# EAGLE design moodyv1_final_rzl (EAGLE 6.3)
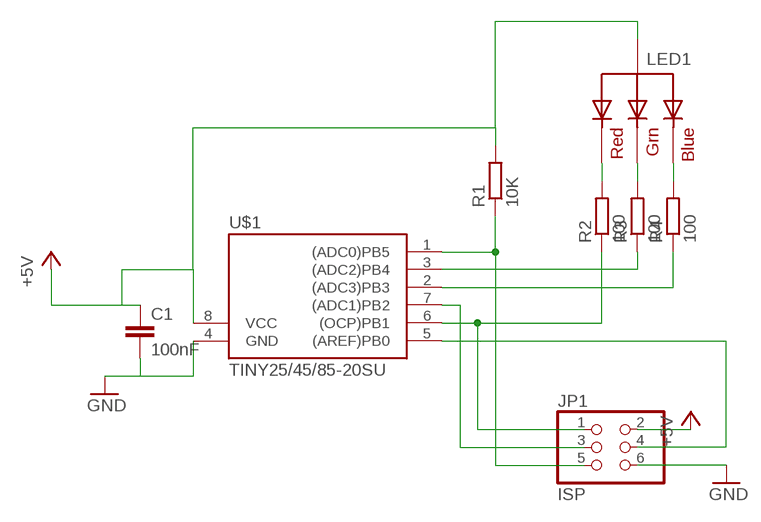
[diagram p0: schematic, sheet 1]

## Parts
C1  100nF  C-EUC0805  [C0805]
JP1  ISP  PINHD-2X03_2.54-SMD  [2X03SMD]
LED1  RGBLED_CA-PIRANHA  [PIRANHA5MM]
R1  10K  R-EU_R1206  [R1206]
R2  100  R-EU_R0805  [R0805]
R3  100  R-EU_R0805  [R0805]
R4  100  R-EU_R0805  [R0805]
U$1  TINY25/45/85-20SU  [SOIC8]

## Nets
+5V: C1.1 JP1.2 LED1.4(VCC) R1.2 U$1.8(VCC)
GND: C1.2 JP1.6 U$1.4(GND)
N$2: JP1.5 R1.1 U$1.1((ADC0)PB5)
N$3: LED1.2(RED) R2.2
N$4: LED1.3(GREEN) R3.2
N$5: LED1.1(BLUE) R4.2
N$6: JP1.4 U$1.5((AREF)PB0)
N$7: JP1.3 U$1.7((ADC1)PB2)
N$8: JP1.1 R2.1 U$1.6((OCP)PB1)
N$9: R4.1 U$1.2((ADC3)PB3)
N$10: R3.1 U$1.3((ADC2)PB4)

## Library data of the parts
C1 = resistor:C-EU: CAPACITOR, European symbol
JP1 = pinhead-2:PINHD-2X03: PIN HEADER
LED1 = adafruit:RGBLED_CA: RGB LED, common-anode 5MM Staggered pins 5mm Piranha package http://www.ladyada.net/library/pcb/eaglelibrary.html
R1-R4 = resistor:R-EU_: RESISTOR, European symbol
U$1 = avr-7:TINY25/45/85

## Net classes
0 default: clearance 0.355 mm

## Board
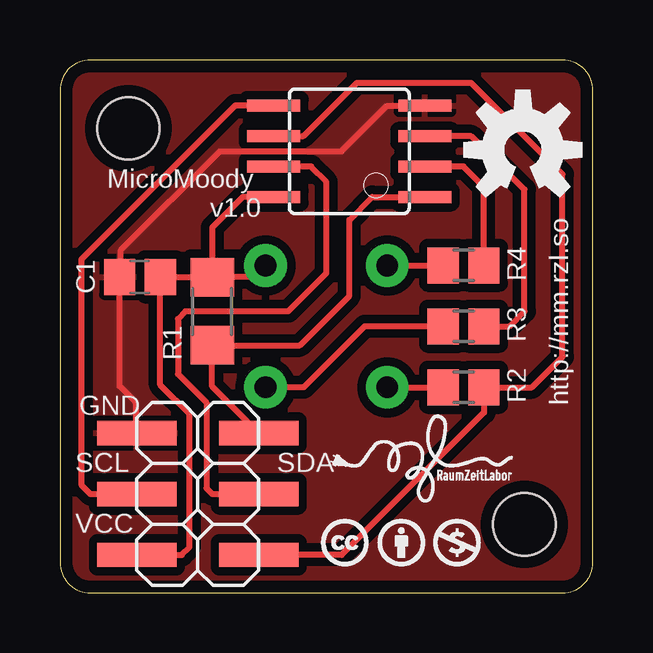
[diagram p1: board, top side]
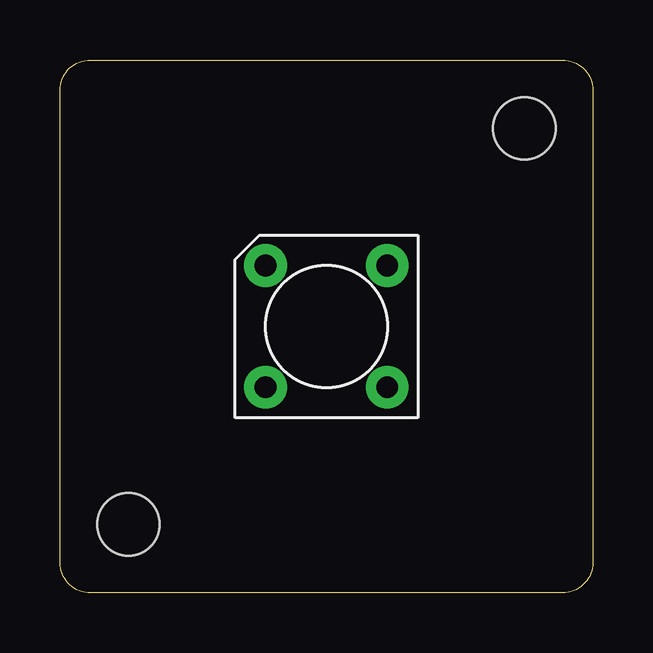
[diagram p2: board, bottom side, seen from below]

Size 22.23 x 22.22 mm. Coordinates in mm from the lower left corner, seen from the top.
Outline: 20.96,22.22 1.27,22.22 arc90 0,20.95 0,1.27 arc90 1.27,0 20.96,0 arc90 22.23,1.27 22.23,20.95 arc90 20.96,22.22
Copper layers (1*16): Top 0.035mm / dielectric 1.5mm / Bottom 0.035mm
Design rules "multi-cb_035um-cu *": minimum track width 6mil, minimum drill 12mil, track to track 6mil, track to pad 6mil, pad to pad 6mil, via to via 6mil, smd to smd 6mil, copper to edge 20mil, drill to drill 8mil, minimum pad ring 8mil, minimum via ring 6mil, stop-mask expansion 3mil, vias tented up to drill 0mil, thermal gap 8mil
Holes 2.6 mm at 19.37,2.86 2.86,19.37

### Footprints (pad centres in the part's own frame; a part is rotated, then mirrored left to right if it is on the bottom)
C0805 = smd 1.3 x 1.5: 1 -0.85,0; 2 0.85,0
2X03SMD = smd 1.016 x 3.302: 1 -1.27,-3.81; 2 -1.27,1.27; 3 1.27,-3.81; 4 1.27,1.27; 5 3.81,-3.81; 6 3.81,1.27
PIRANHA5MM = drill 0.9 pad 1.778: 1 -2.54,2.54; 2 -2.54,-2.54; 3 2.54,-2.54; 4 2.54,2.54
R1206 = smd 1.6 x 1.803: 1 -1.422,0; 2 1.422,0
R0805 = smd 1.3 x 1.5: 1 -0.85,0; 2 0.85,0
SOIC8 = smd 0.5 x 2.2: 1 -1.905,-3.154; 2 -0.645,-3.154; 3 0.625,-3.154; 4 1.895,-3.154; 5 1.905,3.154; 6 0.635,3.154; 7 -0.635,3.154; 8 -1.905,3.154

### Placement (x,y rotation side)
C1  3.33,13.18 180 top
JP1  4.48,2.86 90 top
LED1  11.11,11.11 0 bottom
R1  6.35,11.75 90 top
R2  16.83,8.57 180 top
R3  16.83,11.11 180 top
R4  16.83,13.65 180 top
U$1  12.07,18.41 90 top

### Tracks (layer width: path | path; a pad name or v marks a point on that pad's centre or on a via)
+5V
  Top 0.254: LED1.4 8.09,13.17 R1.2 | R1.2 C1.1 4.18,8.67 5.4,7.46 5.4,1.9 5.08,1.59 JP1.2 | U$1.8 7.62,16.51 6.35,15.24 R1.2
GND
  Top 0.254: U$1.4 13.64,20.31 11.75,18.41 6.67,18.41 2.54,14.29 2.54,13.23 C1.2 2.48,8.63 3.18,7.94 3.18,6.7 JP1.6
  pour Top: 22.07,0.16 22.23,22.07 0.16,22.07 0.16,0.16
N$2
  Top 0.254: U$1.1 13.02,16.51 12.07,15.56 12.07,12.38 10.01,10.33 R1.1 6.35,8.6 JP1.5
N$3
  Top 0.254: LED1.2 R2.2
N$4
  Top 0.254: R3.2 12.7,11.11 10.16,8.57 LED1.3
N$5
  Top 0.254: LED1.1 R4.2
N$6
  Top 0.254: U$1.5 7.3,20.32 0.89,13.91 0.89,4.51 1.27,4.13 JP1.4
N$7
  Top 0.254: U$1.7 10.48,17.78 11.11,17.15 11.11,13.33 9.53,11.75 5.24,11.75 4.92,11.43 4.92,9.13 6.11,7.94 6.11,4.37 6.35,4.13 JP1.3
N$8
  Top 0.254: U$1.6 10.16,19.05 12.38,21.27 17.14,21.27 20.96,17.46 20.96,9.84 19.68,8.57 R2.1 17.68,7.52 11.75,1.59 JP1.1
N$9
  Top 0.254: R4.1 17.68,16.93 16.83,17.78 15.23,17.78 U$1.2
N$10
  Top 0.254: R3.1 18.73,11.11 19.37,11.75 19.37,16.83 17.16,19.04 U$1.3

### Text on the board
tNames: MicroMoody / v1.0 | http://mm.rzl.so | GND | SCL | SDA | VCC